# Altium schematic sheet MCU.SchDoc
size 259 x 167 mm; SheetNumber: 11; SheetTotal: 15
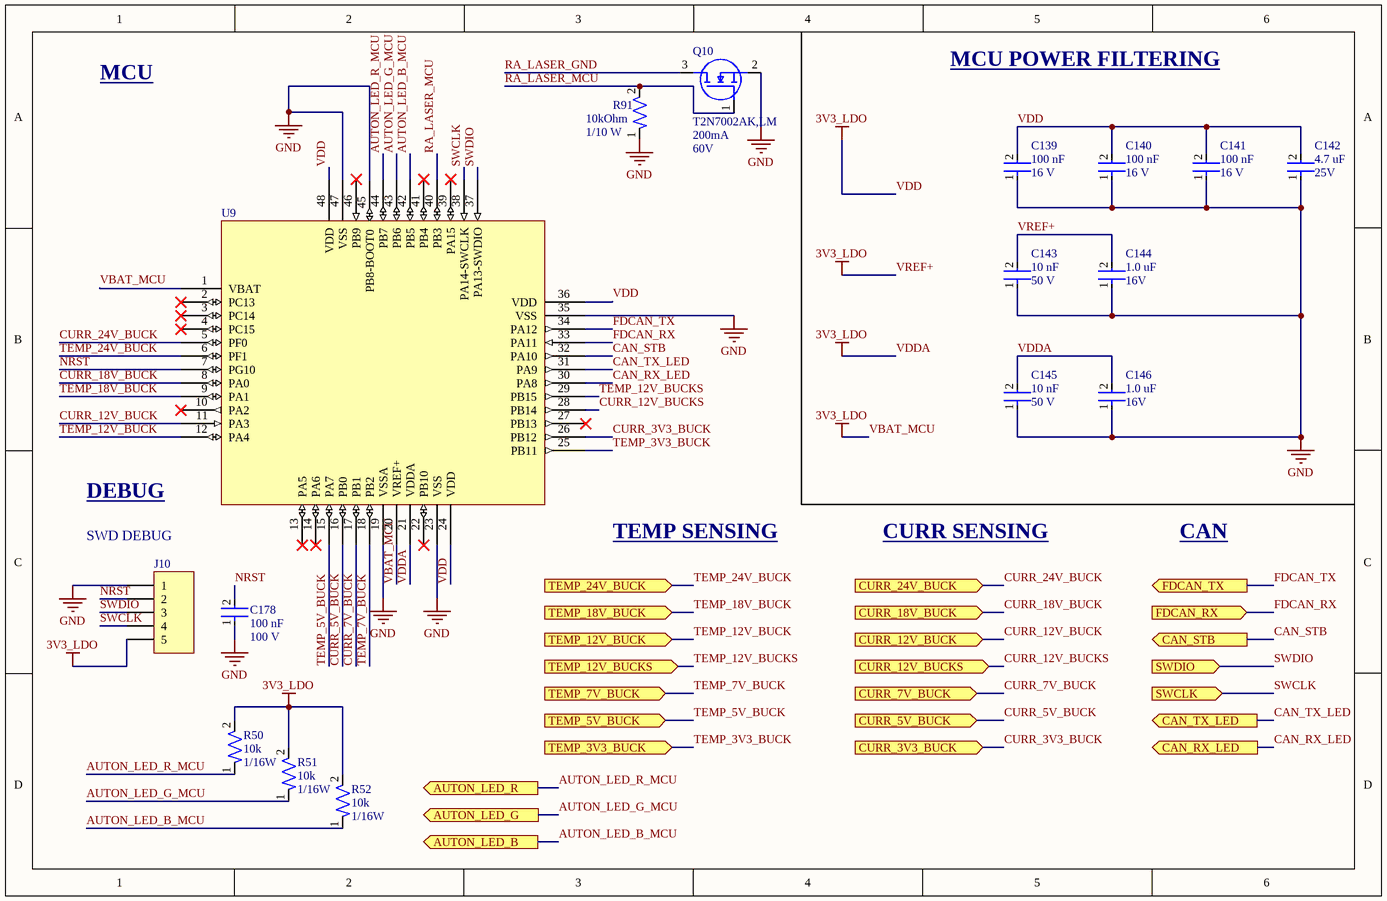
[diagram p0: MCU.SchDoc]

## Parts
C139  Voltage Rating: 16 V  Capacitance: 100 nF  [CAP-0402]  (hidden comment: CC0402KRX7R7BB104)
C140  Voltage Rating: 16 V  Capacitance: 100 nF  [CAP-0402]  (hidden comment: CC0402KRX7R7BB104)
C141  Voltage Rating: 16 V  Capacitance: 100 nF  [CAP-0402]  (hidden comment: CC0402KRX7R7BB104)
C142  Capacitance: 4.7 uF  Voltage: 25V  [CAP-0603]  (hidden comment: CC0603KRX5R8BB475)
C143  Voltage: 50 V  Capacitance: 10 nF  [CAP-0603]  (hidden comment: CC0603KPX7R9BB103)
C144  Capacitance: 1.0 uF  Voltage: 16V  [CAP-0603]  (hidden comment: CC0603KRX7R7BB105)
C145  Voltage: 50 V  Capacitance: 10 nF  [CAP-0603]  (hidden comment: CC0603KPX7R9BB103)
C146  Capacitance: 1.0 uF  Voltage: 16V  [CAP-0603]  (hidden comment: CC0603KRX7R7BB105)
C178  Capacitance: 100 nF  Voltage: 100 V  [CAP-0603]  (hidden comment: CC0603KRX7R0BB104)
J10  Header 5  [HDR1X5]  (value not drawn)
Q10  T2N7002AK,LM  Id-Continuous: 200mA  VDS-Max: 60V  [NMOS-SOT23-3]
R50  Resistance: 10k  Power: 1/16W  [RES-0402]  (hidden comment: RC0402FR-0710KL)
R51  Resistance: 10k  Power: 1/16W  [RES-0402]  (hidden comment: RC0402FR-0710KL)
R52  Resistance: 10k  Power: 1/16W  [RES-0402]  (hidden comment: RC0402FR-0710KL)
R91  Resistance: 10kOhm  Power: 1/10 W  [RES-0603]  (hidden comment: RMCF0603ZT0R00)
U9  STM32G431CBT6  [IC-LQFP48]  (value not drawn)

## Ports
AUTON_LED_B (out, see Connectors[5D]), AUTON_LED_G (out, see Connectors[5C]), AUTON_LED_R (out, see Connectors[5C]), CAN_RX_LED (out, see CAN_Transceiver[1C]), CAN_STB (out, see CAN_Transceiver[1C]), CAN_TX_LED (out, see CAN_Transceiver[1C]), CURR_3V3_BUCK (in, see Current_Sens[2D]), CURR_5V_BUCK (in, see Current_Sens[6C]), CURR_7V_BUCK (in, see Current_Sens[4C]), CURR_12V_BUCK (in), CURR_12V_BUCKS (in), CURR_18V_BUCK (in, see Current_Sens[4A]), CURR_24V_BUCK (in, see Current_Sens[2A]), FDCAN_RX (in, see CAN_Transceiver[1C], Connectors[5D]), FDCAN_TX (out, see CAN_Transceiver[1C], Connectors[5D]), SWCLK (in, see Connectors[5D]), SWDIO (in, see Connectors[5D]), TEMP_3V3_BUCK (in), TEMP_5V_BUCK (in), TEMP_7V_BUCK (in), TEMP_12V_BUCK (in), TEMP_12V_BUCKS (in), TEMP_18V_BUCK (in), TEMP_24V_BUCK (in)

## Nets
GND: C139.1 C140.1 C141.1 C142.1 C143.1 C144.1 C145.1 C146.1 C178.1 J10.1 Q10.2(S) R91.1 U9.19(VSSA) U9.23(VSS) U9.35(VSS) U9.45(PB8-BOOT0) U9.47(VSS)
VBAT_MCU: C139.2 C140.2 C141.2 C142.2 C143.2 C144.2 C145.2 C146.2 J10.5 R50.2 R51.2 R52.2 U9.1(VBAT) U9.20(VREF+) U9.21(VDDA) U9.24(VDD) U9.36(VDD) U9.48(VDD)  [also labelled 3V3_LDO, VDD, VDDA, VREF+]
AUTON_LED_B_MCU: R52.1 U9.42(PB5) ; port AUTON_LED_B
AUTON_LED_G_MCU: R51.1 U9.43(PB6) ; port AUTON_LED_G
AUTON_LED_R_MCU: R50.1 U9.44(PB7) ; port AUTON_LED_R
CAN_RX_LED: U9.30(PA8) ; port CAN_RX_LED
CAN_STB: U9.32(PA10) ; port CAN_STB
CAN_TX_LED: U9.31(PA9) ; port CAN_TX_LED
CURR_3V3_BUCK: U9.26(PB12) ; port CURR_3V3_BUCK
CURR_5V_BUCK: U9.16(PB0) ; port CURR_5V_BUCK
CURR_7V_BUCK: U9.17(PB1) ; port CURR_7V_BUCK
CURR_12V_BUCK: U9.11(PA3) ; port CURR_12V_BUCK
CURR_12V_BUCKS: U9.28(PB14) ; port CURR_12V_BUCKS
CURR_18V_BUCK: U9.8(PA0) ; port CURR_18V_BUCK
CURR_24V_BUCK: U9.5(PF0) ; port CURR_24V_BUCK
FDCAN_RX: U9.33(PA11) ; port FDCAN_RX
FDCAN_TX: U9.34(PA12) ; port FDCAN_TX
NRST: C178.2 J10.2 U9.7(PG10)
RA_LASER_GND: Q10.3(D)
RA_LASER_MCU: Q10.1(G) R91.2 U9.40(PB3)
SWCLK: J10.4 U9.38(PA14-SWCLK) ; port SWCLK
SWDIO: J10.3 U9.37(PA13-SWDIO) ; port SWDIO
TEMP_3V3_BUCK: U9.25(PB11) ; port TEMP_3V3_BUCK
TEMP_5V_BUCK: U9.15(PA7) ; port TEMP_5V_BUCK
TEMP_7V_BUCK: U9.18(PB2) ; port TEMP_7V_BUCK
TEMP_12V_BUCK: U9.12(PA4) ; port TEMP_12V_BUCK
TEMP_12V_BUCKS: U9.29(PB15) ; port TEMP_12V_BUCKS
TEMP_18V_BUCK: U9.9(PA1) ; port TEMP_18V_BUCK
TEMP_24V_BUCK: U9.6(PF1) ; port TEMP_24V_BUCK

Not connected (* = marked no-connect by the designer): U9 2(PC13)* 3(PC14)* 4(PC15)* 10(PA2)* 13(PA5)* 14(PA6)* 22(PB10)* 27(PB13)* 39(PA15)* 41(PB4)* 46(PB9)*

## Notes on the sheet
- MCU
- MCU POWER FILTERING
- DEBUG
- (near J10) SWD DEBUG
- TEMP SENSING
- CURR SENSING
- CAN

## Library data of the parts
C139-C141 = CAP-0.1U-0001: CAP CER 0.1UF 16V X7R 0402; ComponentLink2Description: Datasheet; ComponentLink2URL: https://www.yageo.com/upload/media/product/productsearch/datasheet/mlcc/UPY-GPHC_X7R_6.3V-to-250V_24.pdf; Device Class: Ceramic; Size: 0402
C142 = CAP-4.7U-0001: CAP CER 4.7UF 25V X5R 0603; Device Class: Ceramic; Size: 0603
C143 C145 = CAP-10N-0002: CAP CER 10000PF 50V X7R 0603; ComponentLink2Description: Datasheet; ComponentLink2URL: http://www.yageo.com/documents/recent/UPY-GPHC_X7R_6.3V-to-50V_18.pdf; Device Class: Ceramic; Size: 0603
C144 C146 = CAP-1U-0002: CAP CER 1UF 16V X7R 0603; Device Class: Ceramic; Size: 0603
C178 = CAP-100N-0001: CAP CER 0.1UF 100V X7R 0603; Device Class: Ceramic; Size: 0603; ComponentLink1Description: Datasheet; ComponentLink1URL: https://www.yageo.com/upload/media/product/app/datasheet/mlcc/upy-np0x7r_mv_100-to-630v.pdf
J10 = Header 5: Header, 5-Pin; LatestRevisionDate: 17-Jul-2002; LatestRevisionNote: Re-released for DXP Platform.; Publisher: Altium Limited
Q10 = NMOS-200MA-0001: MOSFET N-CH 60V 200MA SOT23; Manufacturer: Toshiba; FET type: N-Channel; Rds On-Max: 3.9Ohm; Vgs-Max: 20V; Assembled?: no; Manufacturer Part Number: T2N7002AK,LM; Package: SOT-23-3
R50-R52 = RES-10k-0001: RES 10K OHM 1% 1/16W 0402; Tolerance: 1%; Size: 0402; ComponentLink1Description: Datasheet; ComponentLink1URL: https://www.yageo.com/upload/media/product/products/datasheet/rchip/PYu-RC_Group_51_RoHS_L_12.pdf
R91 = RES-0-0001: 0 Ohms Jumper 0.1W, 1/10W Chip Resistor 0603 (1608 Metric) Automotive AEC-Q200 Thick Film; Package Size: 0603
U9 = IC-STM32G431CBT6: IC MCU 32BIT 128KB FLASH 48LQFP; Package: 48LQFP; ComponentLink1Description: Datasheet; ComponentLink1URL: https://www.st.com/resource/en/datasheet/stm32g431cb.pdf